# Altium schematic sheet Sheet3.SchDoc
size A; SheetNumber: 1; SheetTotal: 1
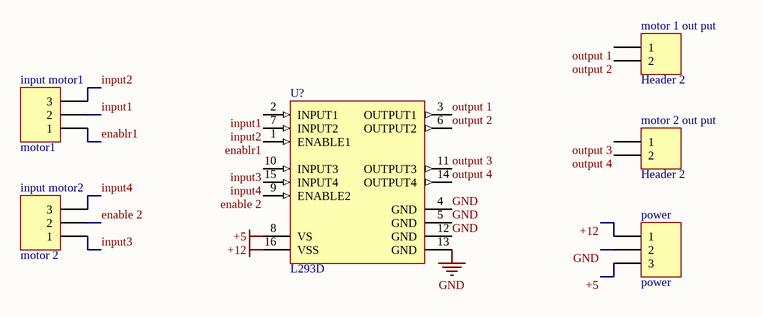
[diagram p0: Sheet3.SchDoc]

## Parts
input_motor1  motor1  [HDR1X3]
input_motor2  motor 2  [HDR1X3]
motor_1_out_put  Header 2  [HDR1X2]
motor_2_out_put  Header 2  [HDR1X2]
power  power  [HDR1X3]
U?  L293D  [STM-L293D-16]

## Nets
+5: power.3 U?.8(VS)
+12: power.1 U?.16(VSS)
GND: power.2 U?.4(GND) U?.5(GND) U?.12(GND) U?.13(GND)
enable 2: input_motor2.2 U?.9(ENABLE2)
enablr1: input_motor1.1 U?.1(ENABLE1)
input1: input_motor1.2 U?.2(INPUT1)
input2: input_motor1.3 U?.7(INPUT2)
input3: input_motor2.1 U?.10(INPUT3)
input4: input_motor2.3 U?.15(INPUT4)
output 1: motor_1_out_put.1 U?.3(OUTPUT1)
output 2: motor_1_out_put.2 U?.6(OUTPUT2)
output 3: motor_2_out_put.1 U?.11(OUTPUT3)
output 4: motor_2_out_put.2 U?.14(OUTPUT4)

## Library data of the parts
input_motor1 input_motor2 power = Header 3: Header, 3-Pin; LatestRevisionDate: 17-Jul-2002; LatestRevisionNote: Re-released for DXP Platform.; Publisher: Altium Limited
motor_1_out_put motor_2_out_put = Header 2: Header, 2-Pin; LatestRevisionDate: 17-Jul-2002; LatestRevisionNote: Re-released for DXP Platform.; Publisher: Altium Limited
U? = CMP-2000-06524-1: Push-Pull Four Channel Driver with Diode, 4.5 to 36 V, -40 to 150 degC, 16-Pin PDIP, RoHS, Tube; Manufacturer: STMicroelectronics; Number of Outputs: 4; Current - Peak Output: 1.2A; Current - Output / Channel: 600mA; Input Type: Non-Inverting; Other Related Documents: L293DViewAllSpecifications; Dynamic Catalog: HalfBridge; Voltage - Supply: 4.5V~36V; Other Names: 497-2936-5; Package / Case: 16-DIP(0.300",7.62mm); PartNumber: L293D; Operating Temperature: -40°C~150°C; Datasheet URL: http://www.st.com/st-web-ui/static/active/en/resource/technical/document/datasheet/CD00000059.pdf; Supplier Device Package: 16-PowerDIP; Packaging: Tube; Package Description: 16-Pin Thru-Hole Dual-In-Line, Body 20 x 6.85 mm, Pitch 2.54 mm; Standard Package: 25; Datasheet Version: 07/2003; On-State Resistance: -; Manufacturer URL: http://www.st.com/; Category: IntegratedCircuits(ICs); Family: PMIC-MOSFET,BridgeDrivers-InternalSwitch; Type: HalfBridge; Series: -; Mounting Technology: ThroughHole; Package Reference: DIP-16; Mounting Type: ThroughHole